# Altium schematic sheet camera.SchDoc
size A4
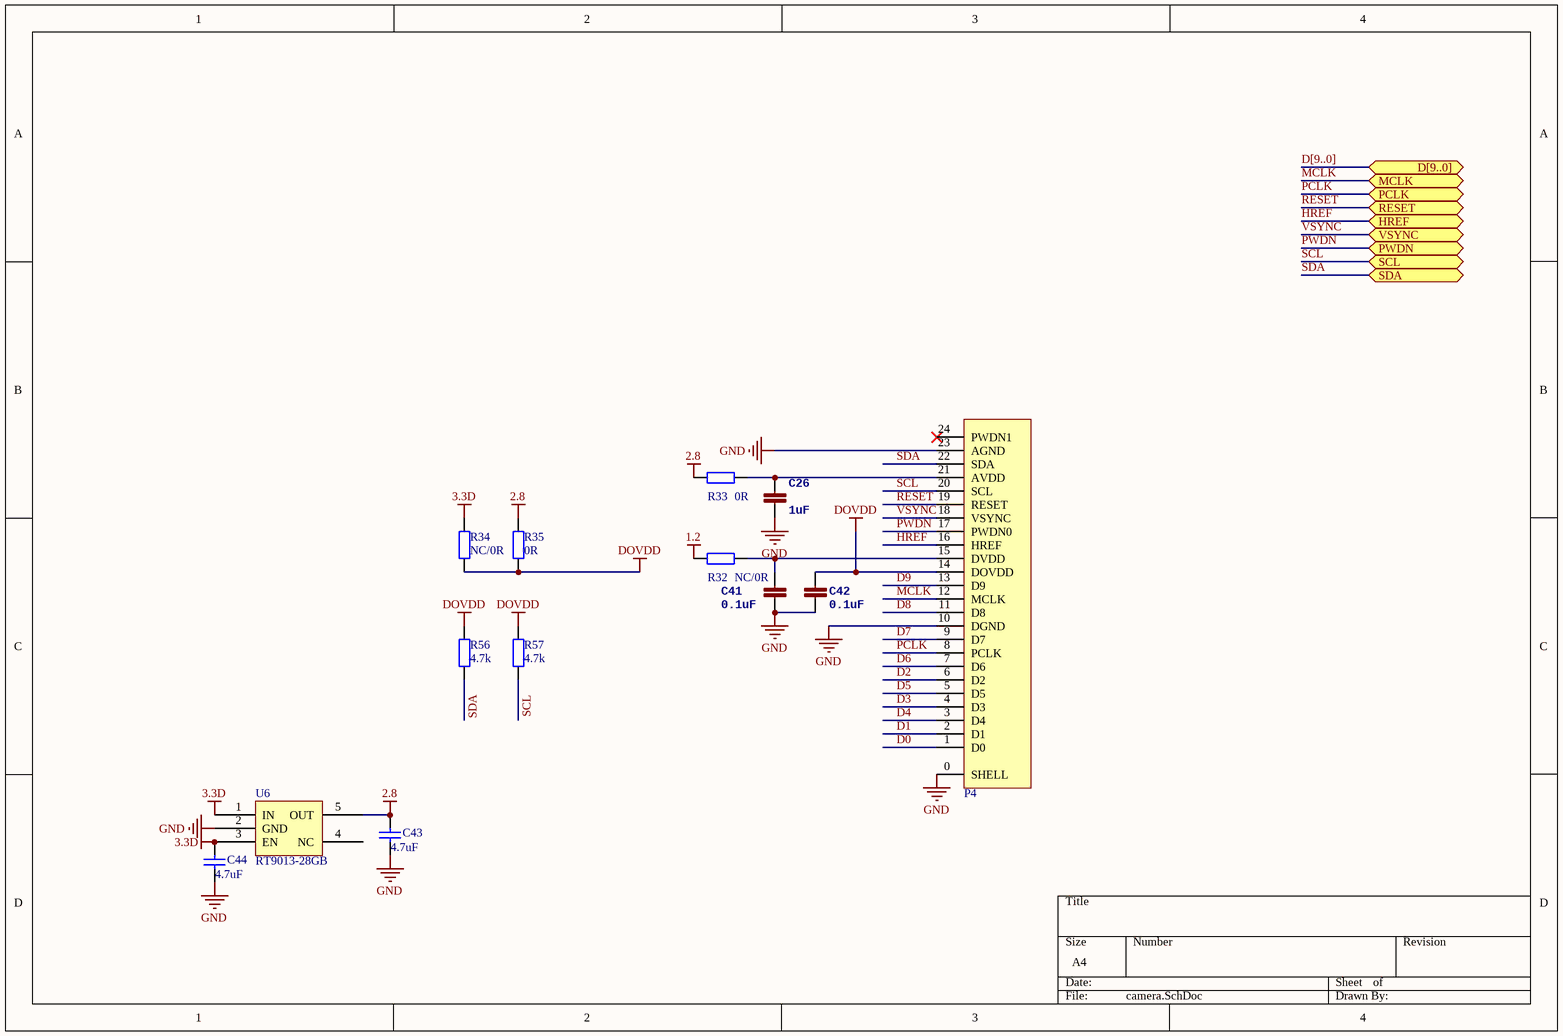
[diagram p0: camera.SchDoc]

## Parts
C26  1uF  [0402]
C41  0.1uF  [0402]
C42  0.1uF  [0402]
C43  4.7uF  [0603]
C44  4.7uF  [0603]
P4  Camera24P-2  [FPC-0.5mm-24]  (value not drawn)
R32  NC/0R  [0402]
R33  0R  [0402]
R34  NC/0R  [0402]
R35  0R  [0402]
R56  4.7k  [0402]
R57  4.7k  [0402]
U6  RT9013-28GB  [SOT23-5]

## Ports
D[9..0], HREF, MCLK, PCLK, PWDN, RESET, SCL, SDA, VSYNC

## Nets
1.2: R32.2
2.8: C43.2 R33.2 R35.1 U6.5(OUT)
3.3D: C44.2 R34.1 U6.1(IN) U6.3(EN)
DOVDD: C42.2 P4.14(DOVDD) R34.2 R35.2 R56.1 R57.1
GND: C26.1 C41.1 C42.1 C43.1 C44.1 P4.0(SHELL) P4.10(DGND) P4.23(AGND) U6.2(GND)
D0: P4.1(D0)
D1: P4.2(D1)
D2: P4.6(D2)
D3: P4.4(D3)
D4: P4.3(D4)
D5: P4.5(D5)
D6: P4.7(D6)
D7: P4.9(D7)
D8: P4.11(D8)
D9: P4.13(D9)
HREF: P4.16(HREF) ; port HREF
MCLK: P4.12(MCLK) ; port MCLK
PCLK: P4.8(PCLK) ; port PCLK
PWDN: P4.17(PWDN0) ; port PWDN
RESET: P4.19(RESET) ; port RESET
SCL: P4.20(SCL) R57.2 ; port SCL
SDA: P4.22(SDA) R56.2 ; port SDA
VSYNC: P4.18(VSYNC) ; port VSYNC
NetC26_2: C26.2 P4.21(AVDD) R33.1
NetC41_2: C41.2 P4.15(DVDD) R32.1

Not connected (* = marked no-connect by the designer): P4 24(PWDN1)*; U6 4(NC)

## Buses and harness runs
bus D[9..0] = port D[9..0]

## Library data of the parts
C26 C41 C42 = CAP0402-CAP: <b>Capacitor</b> / Standard 0603 ceramic capacitor, and 0.1" leaded capacitor.; PARTNO: CC0402ZRY5V7BB104
C43 C44 = Cap: Capacitor; Published: 8-Jun-2000; LatestRevisionDate: 17-Jul-2002; LatestRevisionNote: Re-released for DXP Platform.; PackageReference: RAD-0.3; Publisher: Altium Limited; PackageDescription: Radial Cap, Thru-Hole; 2 Leads; 0.3 in Pin Spacing
R32-R35 R56 R57 = Res2: Resistor; Value: 0Ohm; Published: 8-Jun-2000; LatestRevisionDate: 17-Jul-2002; LatestRevisionNote: Re-released for DXP Platform.; PackageReference: AXIAL-0.4; Publisher: Altium Limited; PackageDescription: Axial Device, Thru-Hole; 2 Leads; 0.4 in Pin Spacing
U6 = LP5907